# Altium schematic sheet power_rf.SchDoc: RF power conversion
size A4; SheetNumber: 8; SheetTotal: 11
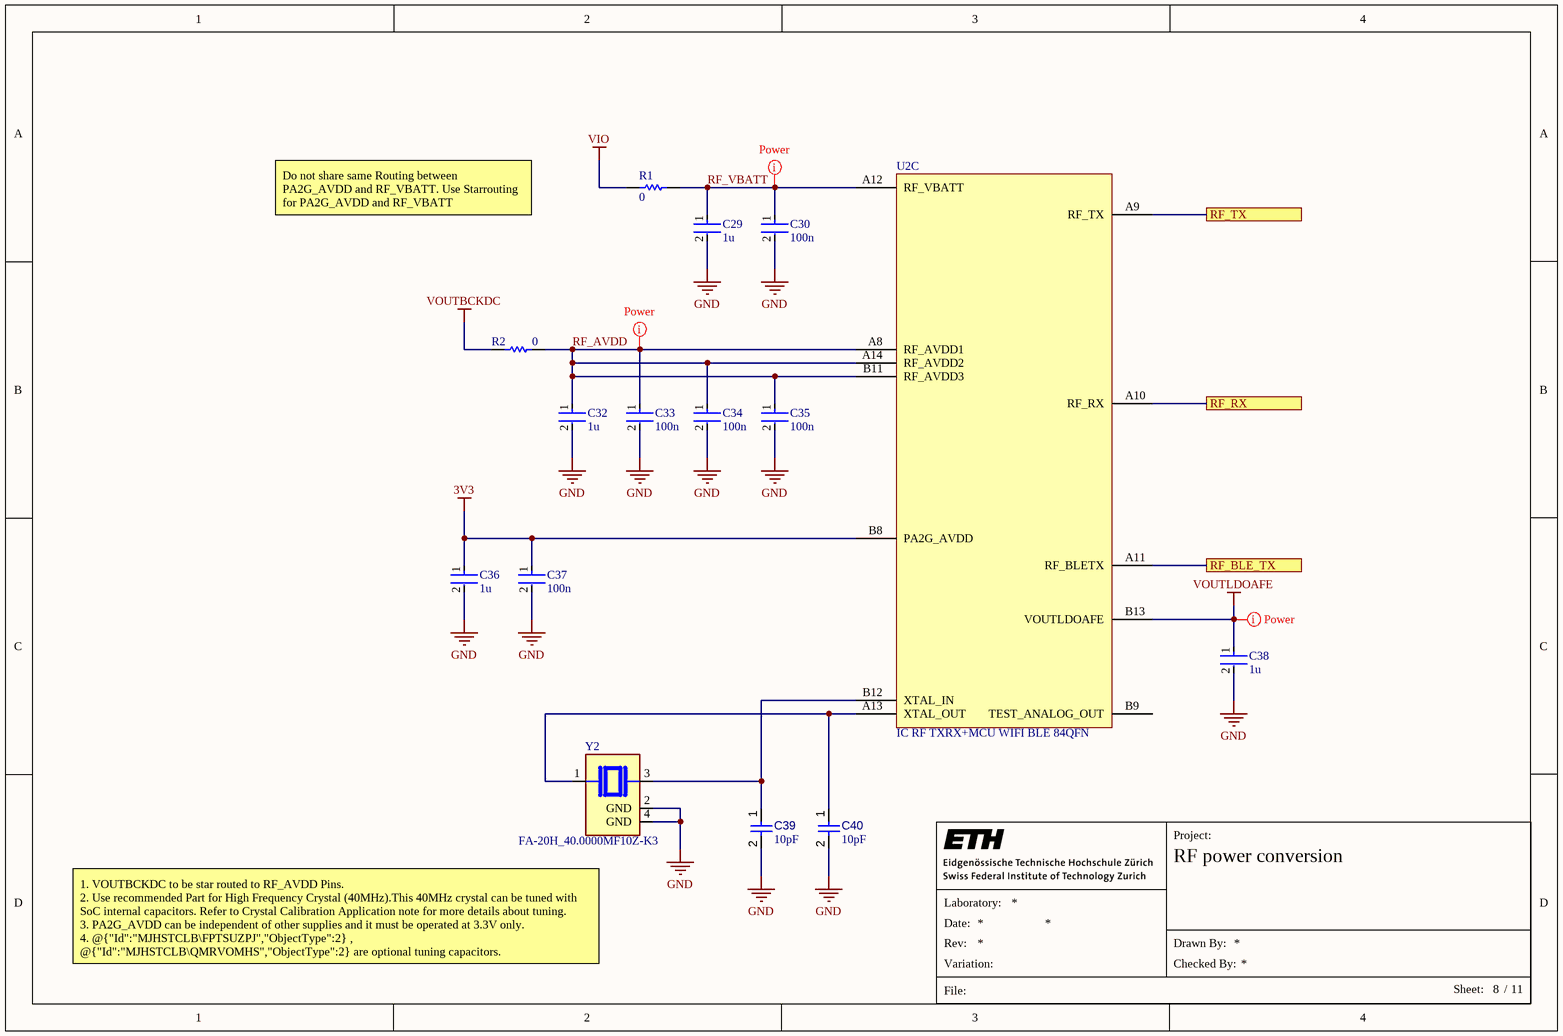
[diagram p0: power_rf.SchDoc]

## Parts
C29  1u  [FP-GRM155-0_05-MFG]
C30  100n  [FP-GRT155-0_05-MFG]
C32  1u  [FP-GRM155-0_05-MFG]
C33  100n  [FP-GRT155-0_05-MFG]
C34  100n  [FP-GRT155-0_05-MFG]
C35  100n  [FP-GRT155-0_05-MFG]
C36  1u  [FP-GRM155-0_05-MFG]
C37  100n  [FP-GRT155-0_05-MFG]
C38  1u  [FP-GRM155-0_05-MFG]
C39  value 10pF  [CAPC1005X55X30LL05T10]  (hidden comment: Capacitor 10 pF +/- 0.25 pF 50 V 0402)
C40  value 10pF  [CAPC1005X55X30LL05T10]  (hidden comment: Capacitor 10 pF +/- 0.25 pF 50 V 0402)
R1  value 0  [RESC1005X40X25ML05T10]  (hidden comment: Resistor 0R 0402 63 mW)
R2  value 0  [RESC1005X40X25ML05T10]  (hidden comment: Resistor 0R 0402 63 mW)
U2  IC RF TXRX+MCU WIFI BLE 84QFN  [SIWG917M110LGTBA]  (part C of 4)
Y2  FA-20H_40.0000MF10Z-K3  [XTAL_FA-20H_40.0000MF10Z-K3]

## Ports
RF_BLE_TX (see power_io[3C], power_io[2C], rf_clocks[4A]), RF_RX (see power_io[3C], power_io[2C], rf_clocks[4B]), RF_TX (see power_io[3C], power_io[2C], rf_clocks[4B])

## Nets
3V3: C36.1 C37.1 U2.B8(PA2G_AVDD)
GND: C29.2 C30.2 C32.2 C33.2 C34.2 C35.2 C36.2 C37.2 C38.2 C39.2 C40.2 Y2.2(GND) Y2.4(GND)
VIO: R1.1
VOUTBCKDC: R2.1
VOUTLDOAFE: C38.1 U2.B13(VOUTLDOAFE)
RF_AVDD: C32.1 C33.1 C34.1 C35.1 R2.2 U2.A8(RF_AVDD1) U2.A14(RF_AVDD2) U2.B11(RF_AVDD3)
RF_BLE_TX: U2.A11(RF_BLETX) ; port RF_BLE_TX
RF_RX: U2.A10(RF_RX) ; port RF_RX
RF_TX: U2.A9(RF_TX) ; port RF_TX
RF_VBATT: C29.1 C30.1 R1.2 U2.A12(RF_VBATT)
NetC39_1: C39.1 U2.B12(XTAL_IN) Y2.3
NetC40_1: C40.1 U2.A13(XTAL_OUT) Y2.1

Not connected (* = marked no-connect by the designer): U2 B9(TEST_ANALOG_OUT)

## Layout directives
net class Power: RF_AVDD, RF_VBATT, VOUTLDOAFE

## Notes on the sheet
- Do not share same Routing between PA2G_AVDD and RF_VBATT. Use Starrouting for PA2G_AVDD and RF_VBATT
- (near Y2) 1. VOUTBCKDC to be star routed to RF_AVDD Pins.
  2. Use recommended Part for High Frequency Crystal (40MHz).This 40MHz crystal can be tuned with SoC internal capacitors. Refer to Crystal Calibration Application note for more details about tuning.
  3. PA2G_AVDD can be independent of other supplies and it must be operated at 3.3V only.
  4. @{"Id":"MJHSTCLB\FPTSUZPJ","ObjectType":2} , @{"Id":"MJHSTCLB\QMRVOMHS","ObjectType":2} are optional tuning capacitors.
  5. @{"Id":"MJHSTCLB\IOXMTIAC","ObjectType":2} , @{"Id":"MJHSTCLB\BRJDNKUM","ObjectType":2} are placeholder components for power supply noise filtering purpose.
- Project:
- Laboratory:
- Date:
- File:
- Rev:
- Variation:
- Drawn By:
- Checked By:
- Sheet:
- /

## Library data of the parts
C29 C32 C36 C38 = CMP-06035-025126-1: Chip Multilayer Ceramic Capacitors for General Purpose, 0402, 1.0uF, X6S, 22%, 10%, 16V; Capacitance: 1uF; Thickness: 500um; Voltage Rating (DC): 16V; Tolerance: 10%; Width: 500um; Length: 1mm; Dielectric: X6S
C30 C33-C35 C37 = CMP-06035-014200-1: Multi-Layer Ceramic Capacitor 100nF 50V X7R ±10% 0402 Paper T/R
C39 C40 = CMP-001-00011-6: Chip Capacitor, 10 pF, +/- 0.25 pF, 50 V, 0402 (1005 Metric); Voltage Rating: 50V; Tolerance: 0.25%; Capacitor Type: Ceramic; Mounting Technology: SM; Pins: 2; Case/Package: 0402; Min Operating Temperature: -55°C; RoHS Compliant: True; Max Operating Temperature: 125°C
R1 R2 = CMP-009-00004-5: Chip Resistor, 0 Ohm, 0.063 W, -55 to 155 degC, 0402 (1005 Metric); Power: 63mW; Voltage Rating: 50V; Max Operating Temperature: 155°C; Pins: 2; RoHS Compliant: True; Min Operating Temperature: -55°C; Mounting Technology: SM; Case/Package: 0402
U2 = SIWG917
Y2 = FA-20H_40.0000MF10Z-K3: MF: {'manufacturer': u'EPSON'}; MP: FA-20H 40.0000MF10Z-K3; Package: None; Price: None; Value: *; Availability: Unavailable; Supplier 1: Future Electronics; Supplier Part Number 1: 6169727